# EAGLE design AutomaticSanitizer (EAGLE 9.2.2)
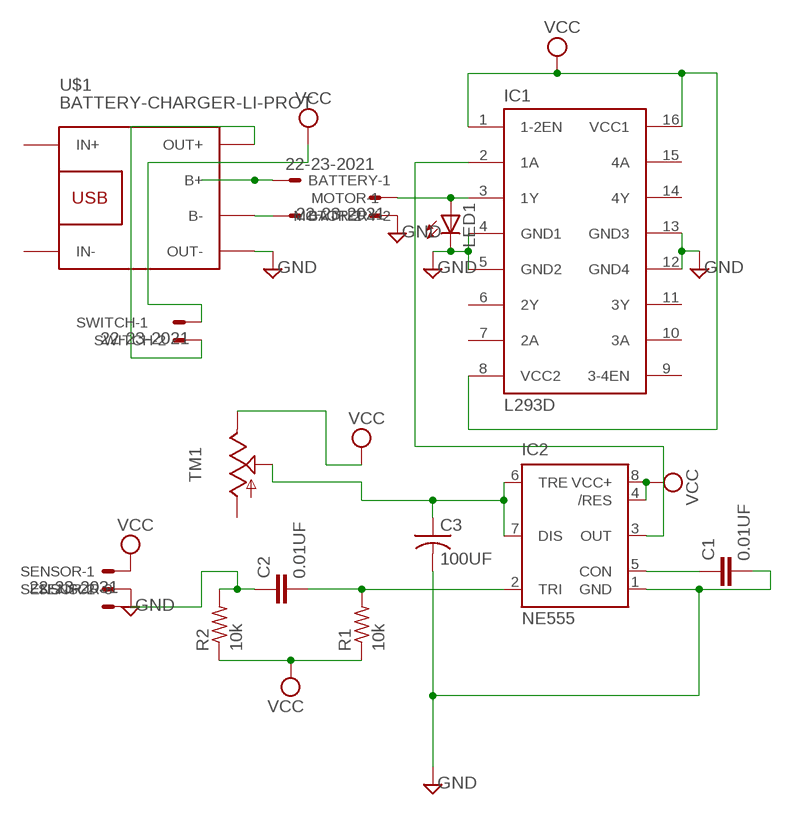
[diagram p0: schematic, sheet 1]

## Parts
BATTERY  22-23-2021  [22-23-2021]
C1  0.01UF  C2.5/2  [C2.5-2]
C2  0.01UF  C2.5/2  [C2.5-2]
C3  100UF  C-US025-025X050  [C025-025X050]
IC1  L293D  [DIL16]
IC2  NE555  [DIL-08]
LED1  LED5MM  [LED5MM]
MOTOR  22-23-2021  [22-23-2021]
R1  10k  R-US_0204/5  [0204/5]
R2  10k  R-US_0204/5  [0204/5]
SENSOR  22-23-2031  [22-23-2031]
SWITCH  22-23-2021  [22-23-2021]
TM1  TRIM  [6MM]
U$1  BATTERY-CHARGER-LI-PROT  [BATTERY-CHARGER-LI-PROT]

## Nets
GND: C1.2 C3.2 IC1.4(GND1) IC1.5(GND2) IC1.12(GND4) IC1.13(GND3) IC2.1(GND) LED1.K(C) MOTOR.2 SENSOR.2 U$1.OUT-
N$1: SWITCH.2 U$1.OUT+
N$3: C3.1 IC2.6(TRE) IC2.7(DIS) TM1.S
N$4: C1.1 IC2.5(CON)
N$5: C2.2 IC2.2(TRI) R1.2
N$6: IC1.2(1A) IC2.3(OUT)
N$7: C2.1 R2.2 SENSOR.3
N$9: BATTERY.1 U$1.B+
N$10: BATTERY.2 U$1.B-
N$11: IC1.3(1Y) LED1.A MOTOR.1
VCC: IC1.1(1-2EN) IC1.8(VCC2) IC1.16(VCC1) IC2.4(/RES) IC2.8(VCC+) R1.1 R2.1 SENSOR.1 SWITCH.1 TM1.E
Unconnected: IC1.6(2Y) IC1.7(2A) IC1.9(3-4EN) IC1.10(3A) IC1.11(3Y) IC1.14(4Y) IC1.15(4A) TM1.A U$1.IN+ U$1.IN-

## Library data of the parts
BATTERY MOTOR SWITCH = con-molex:22-23-2021: .100" (2.54mm) Center Header - 2 Pin; MF: MOLEX; MPN: 22-23-2021; OC_FARNELL: 1462926; OC_NEWARK: 25C3832
C1 C2 = capacitor-wima:C: CAPACITOR naming: grid - package width
C3 = adafruit:C-US: CAPACITOR, American symbol
IC1 = st-microelectronics:L293D: PUSH-PULL 4 CHANNEL DRIVER; MPN: L293D; OC_FARNELL: 9589619; OC_NEWARK: 56P8249
IC2 = st-microelectronics:NE555: General purpose bipolar Timer; MF: Arrow Electronics; MPN: NE555N; OC_FARNELL: 1467742; OC_NEWARK: 89K1486
LED1 = adafruit:LED: LED OSRAM: - CHIPLED LG R971, LG N971, LY N971, LG Q971, LY Q971, LO R971, LY R971 LH N974, LH R974 LS Q976, LO Q976, LY Q976 LO Q996 - Hyper CHIPLED LW Q18S LB Q993, LB Q99A, LB R99A - SideLED LS A670, LO A670, LY A670, LG A670, LP A670 LB A673, LV A673, LT A673, LW A673 LH A674 LY A675 LS A676, LA A676, LO A676, LY A676, LW A676 LS A679, LY A679, LG A679 - Hyper Micro SIDELED® LS Y876, LA Y876, LO Y876, LY Y876 LT Y87S - SmartLED LW L88C, LW L88S LB L89C, LB L89S, LG L890 LS L89K, LO L89K, LY L89K LS L896, LA L896, LO L896, LY L896 - TOPLED LS T670, LO T670, LY T670, LG T670, LP T670 LSG T670, LSP T670, LSY T670, LOP T670, LYG T670 LG T671, LOG T671, LSG T671 LB T673, LV T673, LT T673, LW T673 LH T674 LS T676, LA T676, LO T676, LY T676, LB T676, LH T676, LSB T676, LW T676 LB T67C, LV T67C, LT T67C, LS T67K, LO T67K, LY T67K, LW E67C LS E67B, LA E67B, LO E67B, LY E67B, LB E67C, LV E67C, LT E67C LW T67C LS T679, LY T679, LG T679 LS T770, LO T770, LY T770, LG T770, LP T770 LB T773, LV T773, LT T773, LW T773 LH T774 LS E675, LA E675, LY E675, LS T675 LS T776, LA T776, LO T776, LY T776, LB T776 LHGB T686 LT T68C, LB T68C - Hyper Mini TOPLED® LB M676 - Mini TOPLED Santana® LG M470 LS M47K, LO M47K, LY M47K Source: http://www.osram.convergy.de/
R1 R2 = adafruit:R-US_: RESISTOR, American symbol
SENSOR = con-molex:22-23-2031: .100" (2.54mm) Center Header - 3 Pin; MF: MOLEX; MPN: 22-23-2031; OC_FARNELL: 1462950; OC_NEWARK: 30C0862
TM1 = adafruit:TRIM
U$1 = diy-modules:BATTERY-CHARGER-LI-PROT: Lithium Battery 5V Charger with protection circuit More details available here: http://www.instructables.com/id/DIY-Lithium-ion-Battery-Charger/step4/TP4056-based-lithium-ion-battery-charger-module/ Click here to find device on ebay.com <http://www.ebay.com/sch/tp4056+charger+usb+protection>

## Board
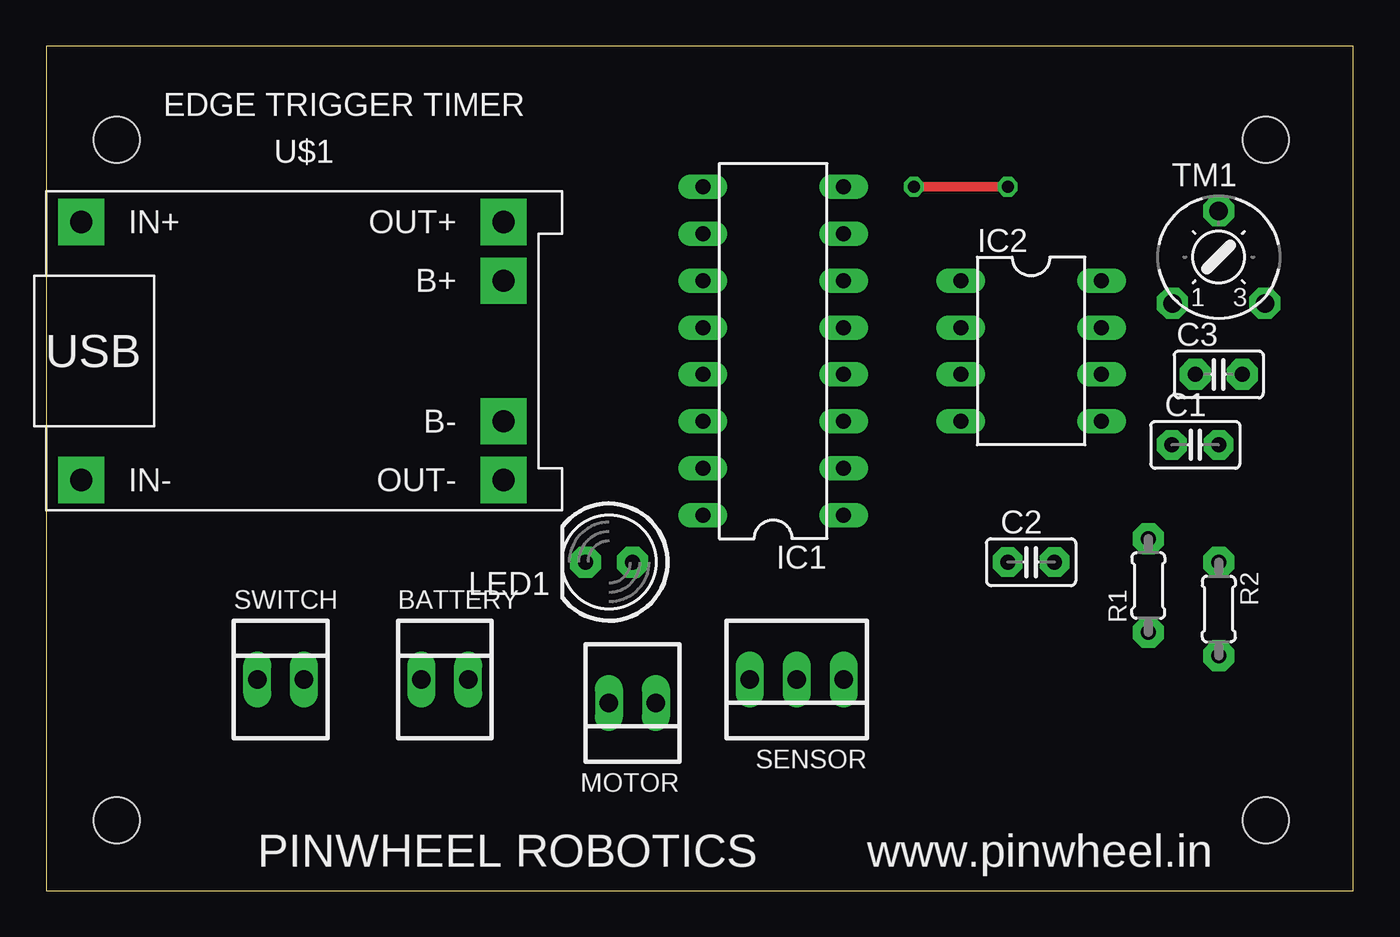
[diagram p1: board, top side]
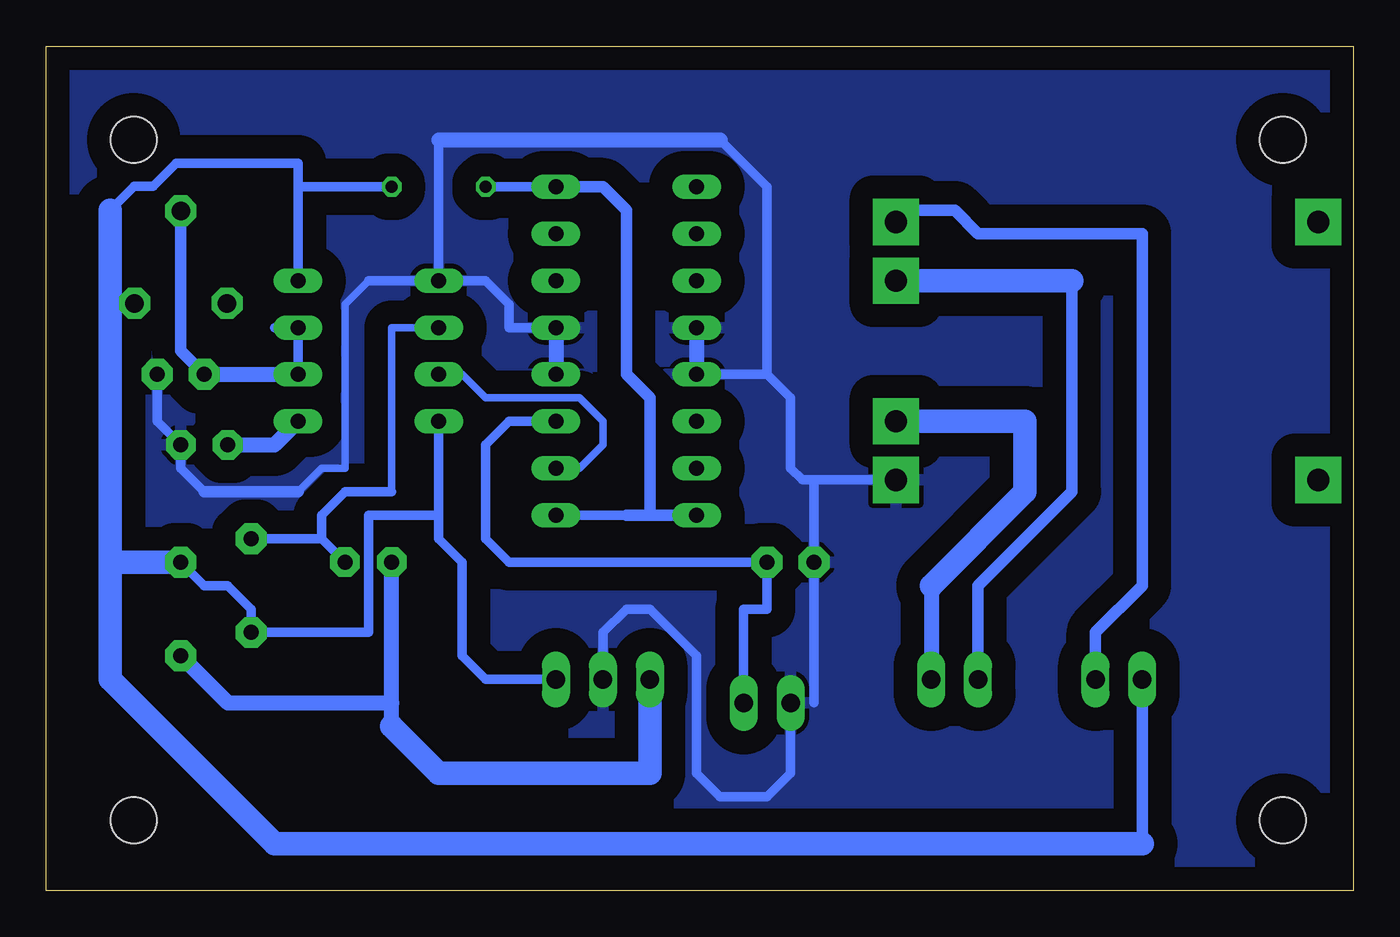
[diagram p2: board, bottom side, seen from below]

Size 70.79 x 45.71 mm. Coordinates in mm from the lower left corner, seen from the top.
Outline: 0,0 70.79,0 70.79,45.71 0,45.71 0,0
Copper layers (1*16): Top 0.035mm / dielectric 1.5mm / Bottom 0.035mm
Design rules "default": minimum track width 6mil, minimum drill 0.35mm, track to track 6mil, track to pad 6mil, pad to pad 6mil, via to via 6mil, smd to smd 6mil, copper to edge 40mil, drill to drill 6mil, minimum pad ring 10mil, minimum via ring 8mil, stop-mask expansion 4mil, vias tented up to drill 0mil, thermal gap 10mil
Holes 2.5 mm at 3.81,40.64 66.04,40.64 3.81,3.81 66.04,3.81

### Footprints (pad centres in the part's own frame; a part is rotated, then mirrored left to right if it is on the bottom)
22-23-2021 = drill 1 long: 1 -1.27,0; 2 1.27,0
C2.5-2 = drill 0.813 pad 1.6 octagon: 1 -1.27,0; 2 1.27,0
C025-025X050 = drill 0.813 pad 1.676 octagon: 1 -1.27,0; 2 1.27,0
DIL16 = drill 0.813 long: 1 -8.89,-3.81; 2 -6.35,-3.81; 3 -3.81,-3.81; 4 -1.27,-3.81; 5 1.27,-3.81; 6 3.81,-3.81; 7 6.35,-3.81; 8 8.89,-3.81; 9 8.89,3.81; 10 6.35,3.81; 11 3.81,3.81; 12 1.27,3.81; 13 -1.27,3.81; 14 -3.81,3.81; 15 -6.35,3.81; 16 -8.89,3.81
DIL-08 = drill 0.813 long: 1 -3.81,-3.81; 2 -1.27,-3.81; 3 1.27,-3.81; 4 3.81,-3.81; 5 3.81,3.81; 6 1.27,3.81; 7 -1.27,3.81; 8 -3.81,3.81
LED5MM = drill 0.813 pad 1.676 octagon: A -1.27,0; K 1.27,0
0204/5 = drill 0.813 pad 1.676 octagon: 1 -2.54,0; 2 2.54,0
22-23-2031 = drill 1 long: 1 -2.54,0; 2 0,0; 3 2.54,0
6MM = drill 1 pad 1.676 octagon: A -2.5,-2.5; E 2.5,-2.5; S 0,2.5
BATTERY-CHARGER-LI-PROT = drill 1.2 pad 2.5 square: B+ 10.795,3.81; B- 10.795,-3.81; IN+ -12.065,6.985; IN- -12.065,-6.985; OUT+ 10.795,6.985; OUT- 10.795,-6.985

### Placement (x,y rotation side)
BATTERY  21.59,11.43 0 top
C1  62.23,24.13 0 top
C2  53.34,17.78 0 top
C3  63.5,27.94 0 top
IC1  39.37,29.21 90 top
IC2  53.34,29.21 270 top
LED1  30.48,17.78 180 top
MOTOR  31.75,10.16 180 top
R1  59.69,16.51 90 top
R2  63.5,15.24 270 top
SENSOR  40.64,11.43 180 top
SWITCH  12.7,11.43 0 top
TM1  63.5,34.29 0 top
U$1  13.97,29.21 0 top

### Tracks (layer width: path | path; a pad name or v marks a point on that pad's centre or on a via)
GND
  Bottom 0.406: 53.34,33.02 54.61,31.75 54.61,22.86 55.88,22.86 57.15,21.59
  Bottom 0.508: SENSOR.2 40.64,13.97 39.37,15.24 38.1,15.24 35.56,12.7 35.56,6.35 34.29,5.08 31.75,5.08 30.48,6.35 MOTOR.2 | 34.29,40.64 31.75,38.1 31.75,27.94 | IC1.5 45.72,30.48 45.72,31.75 46.99,33.02 IC2.1 | U$1.OUT- 29.21,22.22 | 29.21,22.22 29.84,22.22 30.48,22.86 30.48,26.67 31.75,27.94 | 31.75,27.94 IC1.13 | C3.2 64.77,25.4 C1.2 63.5,22.86 62.23,21.59 | IC2.1 53.34,33.02 | IC2.1 49.53,40.64 | 29.21,22.22 LED1.K 29.21,10.16
  Bottom 0.61: 62.23,21.59 57.15,21.59
  Bottom 0.813: IC1.12 IC1.13 | IC1.5 IC1.4 | 49.53,40.64 34.29,40.64
  pour Bottom (isolate 1.27): 0,45.72 71.12,45.72 71.12,0 0,0
N$1
  Bottom 0.61: SWITCH.2 13.97,13.97 11.43,16.51 11.43,35.56 20.32,35.56 21.59,36.83 24.13,36.83 U$1.OUT+
N$3
  Bottom 0.508: IC2.6 IC2.7 58.42,30.48
  Bottom 0.61: C3.1 63.5,29.21 TM1.S
  Bottom 0.813: C3.1 IC2.6
N$4
  Bottom 0.813: C1.1 58.42,24.13 IC2.5
N$5
  Bottom 0.406: IC2.2 52.07,30.48 52.07,21.59
  Bottom 0.508: 55.88,19.05 R1.2 | 52.07,21.59 54.61,21.59 55.88,20.32 55.88,19.05 | C2.2 55.88,19.05
N$6
  Bottom 0.406: IC1.2 41.91,22.86 40.64,24.13 40.64,25.4 41.91,26.67 46.99,26.67 48.26,27.94 IC2.3
N$7
  Bottom 0.813: 52.07,8.89 52.07,10.16 | 52.07,10.16 C2.1 | R2.2 60.96,10.16 52.07,10.16
  Bottom 1.27: SENSOR.3 38.1,6.35 49.53,6.35 52.07,8.89
N$9
  Bottom 0.61: BATTERY.1 20.32,16.51 15.24,21.59 15.24,33.02
  Bottom 1.27: 15.24,33.02 U$1.B+
N$10
  Bottom 0.813: 22.86,16.51 BATTERY.2
  Bottom 1.27: U$1.B- 17.78,25.4 17.78,21.59 22.86,16.51
N$11
  Bottom 0.508: IC1.3 45.72,25.4 46.99,24.13 46.99,19.05 45.72,17.78 LED1.A 31.75,15.24 33.02,15.24 MOTOR.1
VCC  (via drill 0.65)
  Top 0.508: v46.99,38.1 v52.07,38.1
  Bottom 0.508: 67.31,36.83 66.02,38.12 65,38.12 63.75,39.37 57.15,39.37 57.15,38.1 | SENSOR.1 46.99,11.43 48.26,12.7 48.26,17.78 49.53,19.05 49.53,20.32 | 49.53,20.32 IC2.4 | 49.53,20.32 53.34,20.32 53.34,13.97 R1.1 59.69,15.24 60.96,16.51 62.23,16.51 R2.1 | 39.37,20.32 IC1.1 | IC2.8 57.15,38.1 | IC1.8 v46.99,38.1 | v52.07,38.1 57.15,38.1
  Bottom 0.61: IC1.16 38.1,20.32 | 38.1,20.32 39.37,20.32 | 38.1,20.32 38.1,26.67 39.37,27.94 39.37,36.83 40.64,38.1 IC1.8 | SWITCH.1 11.43,2.54 | TM1.E 67.27,31.79 67.31,31.75
  Bottom 1.27: 67.31,36.83 67.31,31.75 67.31,17.78 | 67.31,17.78 R2.1 | 11.43,2.54 58.42,2.54 67.31,11.43 67.31,17.78

### Text on the board
tNames: EDGE TRIGGER TIMER | PINWHEEL ROBOTICS | www.pinwheel.in